# Altium project Jahwa_2.PrjPcb
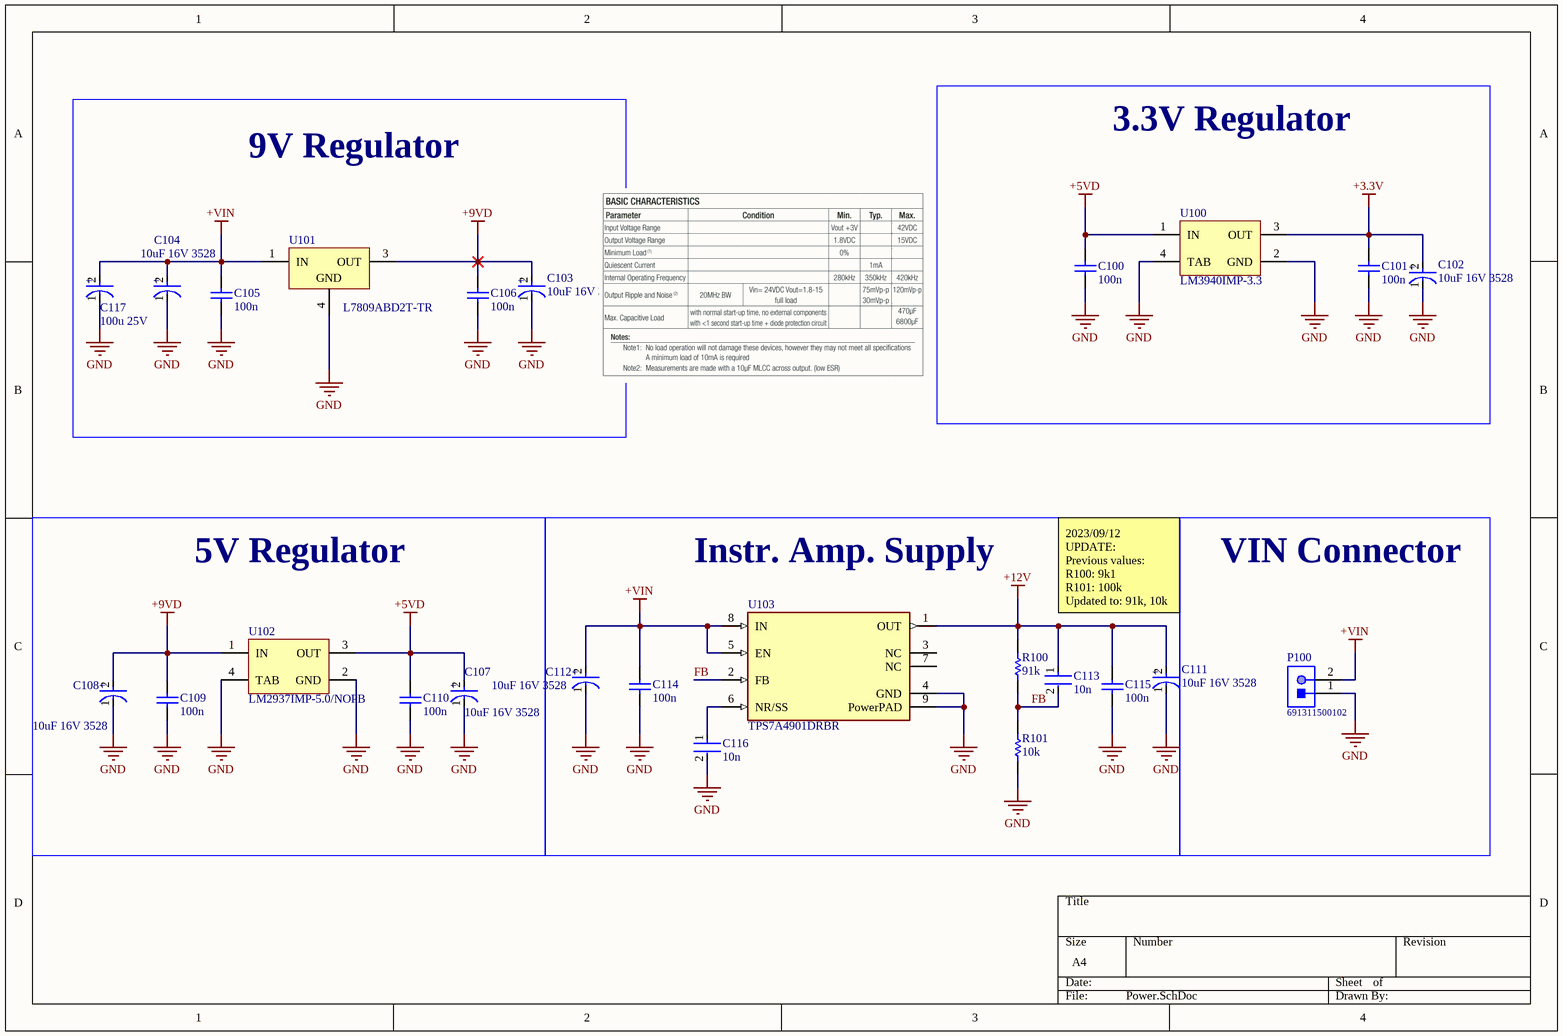
[diagram p0: Power.SchDoc]
4 sheets, 101 parts. Net scope: flat (ports and power ports of the same name join across sheets).
Board file: PCB.PcbDoc
Sheets:
  Power.SchDoc
  ADC.SchDoc
  Source_VDDP.SchDoc
  Source_VDDM.SchDoc

## Sheet Power.SchDoc
size A4; SheetNumber: 2; SheetTotal: 8

### Parts
C100  100n  [SAMS-C0603-2_M]
C101  100n  [SAMS-C0603-2_M]
C102  10uF 16V 3528  [FP-T491B106K020AT-MFG]
C103  10uF 16V 3528  [FP-T491B106K020AT-MFG]
C104  10uF 16V 3528  [FP-T491B106K020AT-MFG]
C105  100n  [SAMS-C0603-2_M]
C106  100n  [SAMS-C0603-2_M]
C107  10uF 16V 3528  [FP-T491B106K020AT-MFG]
C108  10uF 16V 3528  [FP-T491B106K020AT-MFG]
C109  100n  [SAMS-C0603-2_M]
C110  100n  [SAMS-C0603-2_M]
C111  10uF 16V 3528  [FP-T491B106K020AT-MFG]
C112  10uF 16V 3528  [FP-T491B106K020AT-MFG]
C113  10n  [FP-C0603C-CF-MFG]
C114  100n  [SAMS-C0603-2_M]
C115  100n  [SAMS-C0603-2_M]
C116  10n  [FP-C0603C-CF-MFG]
C117  100u 25V  [FP-T491X107K025AT-MFG]
P100  691311500102  [691311500102]
R100  91k  [RESC1608X55X30ML15T15]
R101  10k  [RESC1608X55X30ML15T15]
U100  LM3940IMP-3.3  [DCY0004A_L]
U101  L7809ABD2T-TR  [TO-263_N]
U102  LM2937IMP-5.0/NOPB  [DCY0004A_L]
U103  TPS7A4901DRBR  [FP-DRB0008A-MFG]

### Blocks framed on the sheet
3.3V Regulator: C100-C102 U100
9V Regulator: C103-C106 C117 U101
5V Regulator: C107-C110 U102
Instr. Amp. Supply: C111-C116 R100 R101 U103
VIN Connector: P100

### Nets
+3.3V: C101.2 C102.2(A) U100.3(OUT)
+5VD: C100.2 C107.2(A) C110.2 U100.1(IN) U102.3(OUT)
+9VD: C103.2(A) C106.2 C108.2(A) C109.2 U101.3(OUT) U102.1(IN)
+12V: C111.2(A) C113.1 C115.2 R100.2 U103.1(OUT)
+VIN: C104.2(A) C105.2 C112.2(A) C114.2 C117.2(A) P100.2 U101.1(IN) U103.5(EN) U103.8(IN)
GND: C100.1 C101.1 C102.1(C) C103.1(C) C104.1(C) C105.1 C106.1 C107.1(C) C108.1(C) C109.1 C110.1 C111.1(C) C112.1(C) C114.1 C115.1 C116.2 C117.1(C) P100.1 R101.1 U100.2(GND) U100.4(TAB) U101.4(GND) U102.2(GND) U102.4(TAB) U103.4(GND) U103.9(PowerPAD)
FB: C113.2 R100.1 R101.2 U103.2(FB)
NetC116_1: C116.1 U103.6(NR/SS)

Not connected (* = marked no-connect by the designer): U103 3(NC) 7(NC)

### Notes on the sheet
- 2023/09/12 UPDATE:
  Previous values:
  R100: 9k1
  R101: 100k
  Updated to: 91k, 10k
- (in symbol CMP-2000-07191-2) +
- (in symbol CMP-2000-07204-2) +

### Library data of the parts
C100 C101 C105 C106 C109 C110 C114 C115 = CMP-2000-05332-1: Multi-layer Ceramic Capacitor, -55 to 125 degC, 2-Pin SMD (0603), RoHS, Tape and Reel; Manufacturer: Samsung Electro-Mechanics; Capacitance: 0.1µF; Rated Voltage: 50V; Dielectric: X7R; Tolerance (%): ±10%; Case Size/Dimension: 0603; Datasheet URL: https://datasheet.ciiva.com/29198/456651-da-01-en-vs-kondensator-0605-29198839.pdf; Manufacturer URL: http://www.samsungsem.com/global/index.jsp; Datasheet Version: Nov-10
C102-C104 C107 C108 C111 C112 = CMP-2000-07191-2: CAP TANT 10UF 10% 20V 1411; Polarity: Polar; Life (Hours): 2000Hour; Dissipation Factor: 6%; Leakage Current: 2uA; Dielectric Material: Tantalum; Ripple Current: 201mA; ESR (Equivalent Series Resistance): 2.1R; Weight: 0.002293oz; Max Operating Temperature: 125°C; Failure Rate: 0.001%; Tolerance: 10%; Case Code (Metric): 3528; Case Code (Imperial): 1411; Number of Pins: 2; Case/Package: 1411; Width: 2.8mm; Height: 1.9mm; Voltage Rating: 20V; Voltage: 20V; Lead Free: Lead Free; Features: General Purpose; Radiation Hardening: No; Min Operating Temperature: -55°C; Length: 3.5mm; Mount: Surface Mount; Depth: 2.8mm; Voltage Rating (DC): 20V; Termination: SMD/SMT; Package Quantity: 1; Capacitance: 10uF; Packaging: Tape and Reel; RoHS Compliant: Yes; REACH SVHC: No SVHC; Height - Seated (Max): 0.083inch
C113 C116 = CMP-2006-03038-2: CAP CER 10000PF 200V X7R 0603; Manufacturer: KEMET; Manufacturer Part Number: C0603C103K2RACTU; Material: Ceramic; Value: 10,000 pF; Temperature Coefficient: 30ppm/°C; Tolerance: 0.1; Automotive Grade: Grade 1; Voltage Rating: 200 V; ComponentLink2Description: Datasheet; Package: C0603C-CF; Device Class L2: Capacitors; Mouser Description: Multilayer Ceramic Capacitors MLCC - SMD/SMT 200volts 10000pF X7R 10%; Device Class L3: Ceramic Capacitors; Temperature Range Low: -55°C; Category: Cap; Device Class L1: Passive Components; Lead Free: Yes; Octopart: https://octopart.com/c0603c103k2ractu-kemet-1061947; ComponentLink2URL: https://api.kemet.com/component-edge/download/datasheet/C0603C100J5GACAUTO.pdf; Temperature Characteristic: X7R; Temperature: -55°C to +125°C; Automotive: Yes; Temperature Range High: +125°C; Digikey Description: CAP CER 10000PF 200V X7R 0603; Height: 0.87mm; RoHS: TRUE; Capacitance: 10,000 pF
C117 = CMP-2000-07204-2: CAP TANT 100UF 10% 25V 2917; Leakage Current: 25uA; Ripple Current: 742mA; Polarity: Polar; Dissipation Factor: 8%; Life (Hours): 2000Hour; Dielectric Material: Tantalum; ESR (Equivalent Series Resistance): 300mR; Length: 7.3mm; RoHS Compliant: No; Failure Rate: 0.001%; REACH SVHC: No SVHC; Tolerance: 10%; Mount: Surface Mount; Height - Seated (Max): 0.169inch; Features: General Purpose; Height: 4mm; Package Quantity: 1; Case Code (Metric): 7343; Max Operating Temperature: 125°C; Number of Pins: 2; Radiation Hardening: No; Lead Free: Lead Free; Capacitance: 100uF; Termination: SMD/SMT; Voltage Rating: 25V; Series: T491; Depth: 4.3mm; Construction: Flat; Case/Package: 2917; Min Operating Temperature: -55°C; Voltage Rating (DC): 25V; Width: 4.3mm; Packaging: Tape and Reel; Case Code (Imperial): 2917; Voltage: 25V
P100 = CMP-1502-02146-1: Serie 311 - 5.08mm Close Vertical PCB Header WR-TBL, 2 pin; Manufacturer: Wurth Elektronik; Pin Number: 2; Gender: Male; Operating Temperature: -40to105degC; Package Reference: 691311500102; Packaging: Box; Part Number: 691311500102; Publisher: WurthElektronik; Datasheet URL: http://katalog.we-online.de/em/datasheet/6913115001xx.pdf; Mounting Technology: THT; Pitch: 5.08mm; Manufacturer URL: http://www.we-online.de
R100 = CMP-2000-00683-1: Manufacturer: Panasonic; Part Number: ERJ-3EKF9100V
R101 = CMP-2000-00182-1: Part Number: ERJ-3EKF1003V; Manufacturer: Panasonic
U100 = CMP-0062-01793-3: 1A Low Dropout Regulator for 5V to 3.3V Conversion, 4-pin SOT-223; Manufacturer: Texas Instruments; PackageTopMarking: XYTT*L52B; CompType: LDO IC; PowerWise: N; Code_JEDEC: TO-261-AA; PackageDescription: Molded SOT-223, 6.50 x 3.56 x 1.6mm Body, 4 Lead, 2.3mm Pitch; PinCount: 4; ComponentLink1Description: Datasheet URL; PackageReference: DCY0004A; Code_IPC: SOT223-4; ComponentLink1URL: http://www.ti.com/general/docs/lit/getliterature.tsp?genericPartNumber=LM3940&fileType=pdf; RoHS: N
U101 = CMP-0244-00211-1: Positive Voltage Regulator, 3-Pin D2PAK, Tape and Reel; ComponentLink2URL: http://www.st.com/internet/com/TECHNICAL_RESOURCES/TECHNICAL_LITERATURE/DATASHEET/CD00000444.pdf; PackageDescription: 3-Pin Transistor Outline Package 2.54 mm Pitch, 15.4 mm Lead Span (D2PAK); DatasheetVersion: 16/11/2011; PackageReference: TO-263; PackageVersion: 2011; ComponentLink1Description: Manufacturer URL; ComponentLink1URL: http://www.st.com; ComponentLink2Description: Datasheet
U102 = CMP-0062-01757-3: 500 mA Low Dropout Regulator, 4-pin SOT-223, Pb-Free; Manufacturer: Texas Instruments; PowerWise: N; CompType: LDO IC; PackageTopMarking: XYTT*L71B; Code_IPC: SOT223-4; ComponentLink1Description: Datasheet URL; ComponentLink1URL: http://www.ti.com/general/docs/lit/getliterature.tsp?genericPartNumber=LM2937&fileType=pdf; PackageDescription: Molded SOT-223, 6.50 x 3.56 x 1.6mm Body, 4 Lead, 2.3mm Pitch; PinCount: 4; RoHS: Y; PackageReference: DCY0004A; Code_JEDEC: TO-261-AA
U103 = CMP-04917-000048-2: None; Polarity: Positive; Max Input Voltage: 35V; Output Type: Adjustable; Output Voltage: 33V; Number of Regulators: 1; Quiescent Current: 100uA; Output Current: 150mA; Accuracy: 1.5%; Dropout Voltage: 333mV; Min Current Limit: 220mA; Min Input Voltage: 3V; Max Operating Temperature: 125°C; Min Operating Temperature: -40°C; Lead Free: Lead Free; Number of Pins: 8; Mount: Surface Mount; Packaging: Cut Tape; Number of Outputs: 1; RoHS Compliant: Yes; Contact Plating: Gold; Max Output Current: 150mA

## Sheet ADC.SchDoc
size A4; SheetNumber: 3; SheetTotal: 8
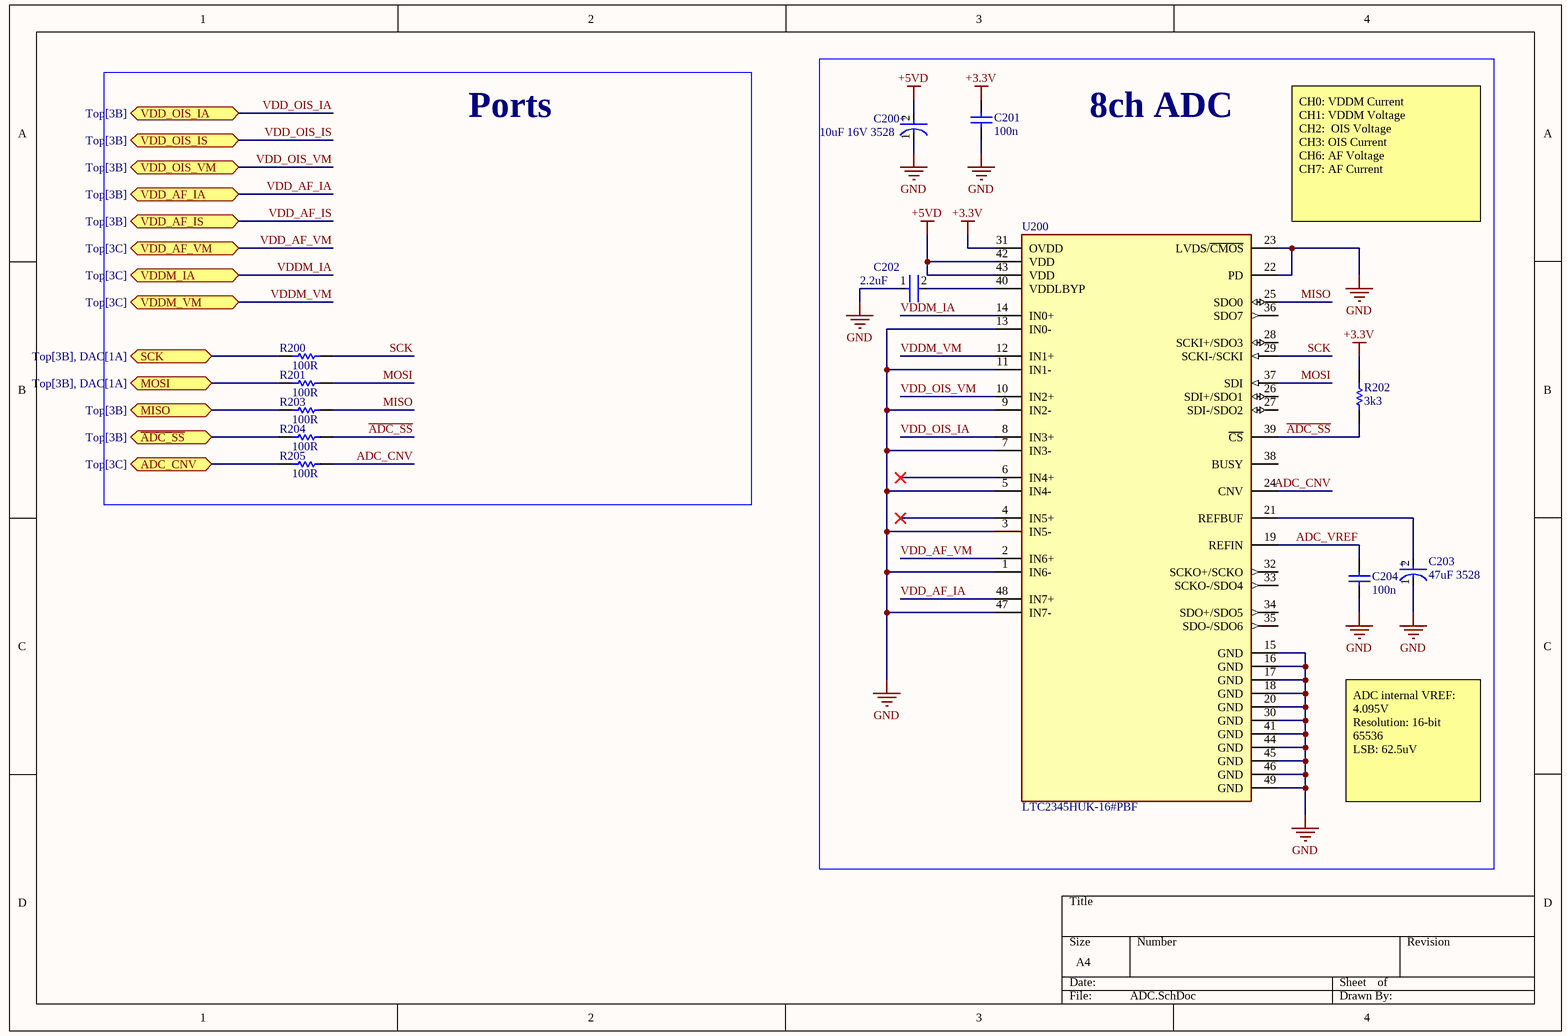
[diagram p1: ADC.SchDoc]

### Parts
C200  10uF 16V 3528  [FP-T491B106K020AT-MFG]
C201  100n  [SAMS-C0603-2_M]
C202  2.2uF  [FP-CL10-IPC_A]
C203  47uF 3528  [FP-TAJB-MFG]
C204  100n  [SAMS-C0603-2_M]
R200  100R  [RESC1608X55X30ML15T15]
R201  100R  [RESC1608X55X30ML15T15]
R202  3k3  [RESC1609X55X30ML15T15]
R203  100R  [RESC1608X55X30ML15T15]
R204  100R  [RESC1608X55X30ML15T15]
R205  100R  [RESC1608X55X30ML15T15]
U200  LTC2345HUK-16#PBF  [FP-UK-48-05-08-1704-MFG]

### Blocks framed on the sheet
Ports: R200 R201 R203-R205
8ch ADC: C200-C204 R202 U200

### Ports
ADC_CNV (bidir, see Top[3C]), MISO (bidir, see Top[3B]), MOSI (bidir, see Top[3B], DAC[1A]), SCK (bidir, see Top[3B], DAC[1A]), VDD_AF_IA (bidir, see Top[3B]), VDD_AF_IS (bidir, see Top[3B]), VDD_AF_VM (bidir, see Top[3C]), VDD_OIS_IA (bidir, see Top[3B]), VDD_OIS_IS (bidir, see Top[3B]), VDD_OIS_VM (bidir, see Top[3B]), VDDM_IA (bidir, see Top[3C]), VDDM_VM (bidir, see Top[3C]), ~{ADC_SS} (bidir, see Top[3B])

### Nets
+3.3V: C201.2 R202.1 U200.31(OVDD)
+5VD: C200.2(A) U200.42(VDD) U200.43(VDD)
GND: C200.1(C) C201.1 C202.1 C203.1(C) C204.1 U200.1(IN6-) U200.3(IN5-) U200.5(IN4-) U200.7(IN3-) U200.9(IN2-) U200.11(IN1-) U200.13(IN0-) U200.15(GND) U200.16(GND) U200.17(GND) U200.18(GND) U200.20(GND) U200.22(PD) U200.23(LVDS/~{CMOS}) U200.30(GND) U200.41(GND) U200.44(GND) U200.45(GND) U200.46(GND) U200.47(IN7-) U200.49(GND)
~{ADC_SS}: R202.2 R204.1 U200.39(~{CS})
ADC_CNV: R205.1 U200.24(CNV)
ADC_VREF: C204.2 U200.19(REFIN)
MISO: R203.1 U200.25(SDO0)
MOSI: R201.1 U200.37(SDI)
SCK: R200.1 U200.29(SCKI-/SCKI)
VDD_AF_IA: U200.48(IN7+) ; port VDD_AF_IA
VDD_AF_IS: port VDD_AF_IS
VDD_AF_VM: U200.2(IN6+) ; port VDD_AF_VM
VDD_OIS_IA: U200.8(IN3+) ; port VDD_OIS_IA
VDD_OIS_IS: port VDD_OIS_IS
VDD_OIS_VM: U200.10(IN2+) ; port VDD_OIS_VM
VDDM_IA: U200.14(IN0+) ; port VDDM_IA
VDDM_VM: U200.12(IN1+) ; port VDDM_VM
NetC202_2: C202.2 U200.40(VDDLBYP)
NetC203_2: C203.2(A) U200.21(REFBUF)
NetR200_2: R200.2 ; port SCK
NetR201_2: R201.2 ; port MOSI
NetR203_2: R203.2 ; port MISO
NetR204_2: R204.2 ; port ~{ADC_SS}
NetR205_2: R205.2 ; port ADC_CNV

Not connected (* = marked no-connect by the designer): U200 4(IN5+)* 6(IN4+)* 26(SDI+/SDO1) 27(SDI-/SDO2) 28(SCKI+/SDO3) 32(SCKO+/SCKO) 33(SCKO-/SDO4) 34(SDO+/SDO5) 35(SDO-/SDO6) 36(SDO7) 38(BUSY)

### Notes on the sheet
- (near U200) CH0: VDDM Current
  CH1: VDDM Voltage
  CH2:  OIS Voltage
  CH3: OIS Current
  CH6: AF Voltage
  CH7: AF Current
- ADC internal VREF: 4.095V
  Resolution: 16-bit
  65536
  LSB: 62.5uV
- (in symbol CMP-2000-07191-2) +
- (in symbol CMP-04424-000629-1) +

### Library data of the parts
C200 = CMP-2000-07191-2: as C102 on sheet Power; Weight: 0.002293oz; Max Operating Temperature: 125°C; Failure Rate: 0.001%; Tolerance: 10%; Case Code (Metric): 3528; Case Code (Imperial): 1411; Number of Pins: 2; Case/Package: 1411; Width: 2.8mm; Height: 1.9mm; Voltage Rating: 20V; Voltage: 20V; Lead Free: Lead Free; Features: General Purpose; Radiation Hardening: No; Min Operating Temperature: -55°C; Length: 3.5mm; Mount: Surface Mount; Depth: 2.8mm; Voltage Rating (DC): 20V; Termination: SMD/SMT; Package Quantity: 1; Capacitance: 10uF; Packaging: Tape and Reel; RoHS Compliant: Yes; REACH SVHC: No SVHC; Height - Seated (Max): 0.083inch
C201 C204 = CMP-2000-05332-1: as C100 on sheet Power; Case Size/Dimension: 0603; Datasheet URL: https://datasheet.ciiva.com/29198/456651-da-01-en-vs-kondensator-0605-29198839.pdf; Manufacturer URL: http://www.samsungsem.com/global/index.jsp; Datasheet Version: Nov-10
C202 = CMP-13271-003582-1: Cap Ceramic 2.2uF 10V X7R ±10% Pad SMD 0603 +125°C T/R; Max Operating Temperature: 125°C; Package Quantity: 1; Thickness: 0.035inch; Capacitance: 2.2uF; Height: 0.8mm; Case/Package: 0603; Case Code (Metric): 1608; Radiation Hardening: No; Dielectric: X7R; Mount: Surface Mount; Contact Plating: Tin; Material: Ceramic; Length: 1.6mm; Packaging: Tape and Reel; Width: 0.031inch; Min Operating Temperature: -55°C; Case Code (Imperial): 0603; Depth: 0.8mm; Voltage Rating: 10V; Tolerance: 10%
C203 = CMP-04424-000629-1: 47uF 10V  ±10% 1Ω 1210  SMD Tantalum Capacitor; Leakage Current: 4.7uA; ESR (Equivalent Series Resistance): 1R; Dissipation Factor: 8%; Polarity: Polar; Package Quantity: 1; Length: 3.5mm; Dielectric Material: Tantalum; Series: TAJ; Termination: SMD/SMT; Case Code (Metric): 3528; Case Code (Imperial): 1210; Height - Seated (Max): 0.083inch; Lead Pitch: 1.4mm; Features: General Purpose; Radiation Hardening: No; Lead Free: Lead Free; Construction: Flat; RoHS Compliant: Yes; Case/Package: 1210; Min Operating Temperature: -55°C; Voltage: 10V; Depth: 2.8mm; Mount: Surface Mount; REACH SVHC: No SVHC; Width: 0.11inch; Voltage Rating (DC): 10V; Max Operating Temperature: 125°C; Capacitance: 47uF; Tolerance: 10%; Voltage Rating: 10V; Packaging: Tape and Reel; Number of Pins: 2; Height: 1.9mm
R200 R201 R203-R205 = CMP-2000-00179-1: Manufacturer: Panasonic; Part Number: ERJ-3EKF1000V
R202 = CMP-2000-00436-2: Chip Resistors, 3.3 KOhm, +/- 1%, 0.1 W, 0603 (1608 Metric), -55 to 155 degC, RoHS, Tape and Reel; Manufacturer: Panasonic; Max Power Dissipation: 100mW; Voltage Rating: 75V; Temperature Coefficient: 100ppm/degreesC; Datasheet Version: 42095.0; Width: 0.8mm; Mount: SurfaceMount; Radiation Hardening: No; Package URL: http://www.st.com/st-web-ui/static/active/en/resource/technical/document/datasheet/CD00001320.pdf; Depth: 0.8mm; Package Description: 2-Pin Surface Mount Device, Body 1.6 x 0.85 mm; Package Quantity: 1; Contact Plating: Tin; Length: 1.6mm; Max Operating Temperature: 155degC; RoHSCompliant: true; Datasheet URL: https://industrial.panasonic.com/cdbs/www-data/pdf/RDA0000/AOA0000C283.pdf; Height: 0.022inch; Military Standard: Not; Termination: SMD/SMT; Case Code (Metric): 1608; Composition: ThickFilm; Resistance: 3.3KOhm; Packaging: TapeandReel; Min Operating Temperature: -55degC; Case/Package: 0603; Voltage Rating (DC): 75V; Lead Free: LeadFree; Package Reference: 0603; Power Rating: 100mW; Manufacturer URL: http://www.panasonic.com/; Case Code (Imperial): 0603; REACH SVHC: NoSVHC; Number of Terminations: 2; Number of Pins: 2; Tolerance: 1%
U200 = CMP-09081-000619-1: IC ADC 16BIT SAR 48QFN; Number of Bits: 16; Resolution: 16b; Input Type: DIFFERENTIAL; Max Supply Voltage: 5.25V; Interface: SPI; Min Supply Voltage: 4.75V; Sampling Rate: 200000S/s; Number of Inputs: 8; Number of A/D Converters: 1; Max Operating Temperature: 125°C; Series: SoftSpan™; Case/Package: QFN; Min Operating Temperature: -40°C; REACH SVHC: No SVHC; RoHS Compliant: Yes; Number of Pins: 48; Packaging: Rail/Tube

## Sheet Source_VDDP.SchDoc
size A4; SheetNumber: 4; SheetTotal: 8
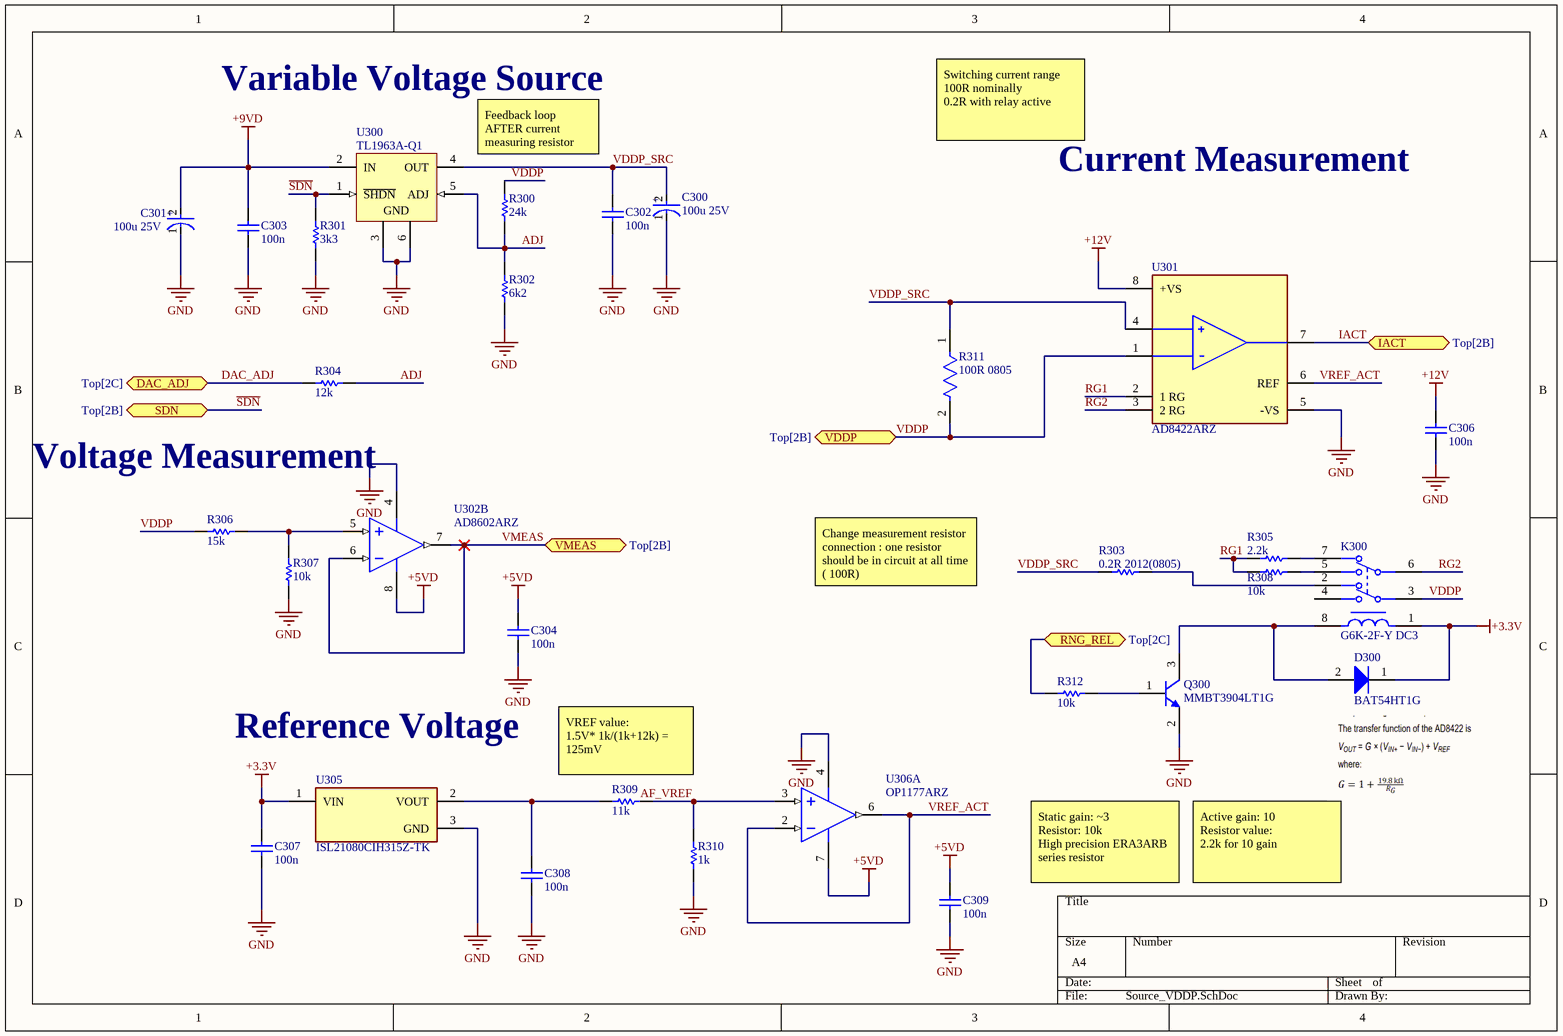
[diagram p2: Source_VDDP.SchDoc]

### Parts
C300  100u 25V  [FP-T491X107K025AT-MFG]
C301  100u 25V  [FP-T491X107K025AT-MFG]
C302  100n  [SAMS-C0603-2_M]
C303  100n  [SAMS-C0603-2_M]
C304  100n  [SAMS-C0603-2_M]
C306  100n  [SAMS-C0603-2_M]
C307  100n  [SAMS-C0603-2_M]
C308  100n  [SAMS-C0603-2_M]
C309  100n  [SAMS-C0603-2_M]
D300  BAT54HT1G  [ONSC-SOD-323-2-477-02_V]
K300  G6K-2F-Y DC3  [FP-G6K-2F-Y_DC3-MFG]
Q300  MMBT3904LT1G  [ONSC-SOT-23-3-318-08_V]
R300  24k  [RESC1608X55X30ML15T15]
R301  3k3  [RESC1609X55X30ML15T15]
R302  6k2  [RESC1608X55X30ML15T15]
R303  0.2R 2012(0805)  [RESC2013X46X38ML25T25]
R304  12k  [RESC1608X55X30ML15T15]
R305  2.2k  [RESC1609X55X30ML15T15]
R306  15k  [RESC1608X55X30ML15T15]
R307  10k  [RESC1608X55X30ML15T15]
R308  10k  [RESC1608X55X30ML15T15]
R309  11k  [RESC1608X55X30ML15T15]
R310  1k  [RESC1608X55X30ML15T15]
R311  100R 0805  [FP-CRCW0805-e3-MFG]
R312  10k  [RESC1608X55X30ML15T15]
U300  TL1963A-Q1  [KTT0005A_M]
U301  AD8422ARZ  [FP-R-8-IPC_A]
U302  AD8602ARZ  [ADI-R-8_N]  (part B of 2)
U305  ISL21080CIH315Z-TK  [FP-P3_064A-IPC_A]
U306  OP1177ARZ  [ADI-R-8_M]  (part A of 2)

### Ports
DAC_ADJ (bidir, see Top[2C]), IACT (bidir, see Top[2B]), RNG_REL (bidir, see Top[2C]), SDN (bidir, see Top[2B]), VDDP (bidir, see Top[2B]), VMEAS (bidir, see Top[2B])

### Nets
+3.3V: C307.2 D300.1(K) K300.1 U305.1(VIN)
+5VD: C304.2 C309.2 U302.8(+V) U306.7(+V)
+9VD: C301.2(A) C303.2 U300.2(IN)
+12V: C306.2 U301.8(+VS)
GND: C300.1(C) C301.1(C) C302.1 C303.1 C304.1 C306.1 C307.1 C308.1 C309.1 Q300.2(E) R301.1 R302.1 R307.1 R310.1 U300.3(GND) U300.6(GND) U301.5(-VS) U302.4(-V) U305.3(GND) U306.4(-V)
~{SDN}: R301.2 U300.1(~{SHDN}) ; port SDN
ADJ: R300.1 R302.2 R304.2 U300.5(ADJ)
AF_VREF: R309.1 R310.2 U306.3(+IN)
DAC_ADJ: R304.1 ; port DAC_ADJ
IACT: U301.7(VOUT) ; port IACT
RG1: R305.1 R308.1 U301.2(1_RG)
RG2: K300.6 U301.3(2_RG)
VDDP: K300.3 R300.2 R306.1 R311.2 U301.1(-IN) ; port VDDP
VDDP_SRC: C300.2(A) C302.2 R303.2 R311.1 U300.4(OUT) U301.4(+IN)
VMEAS: U302.6(-IN_B) U302.7(OUT_B) ; port VMEAS
VREF_ACT: U301.6(REF) U306.2(-IN) U306.6(OUT)
NetC308_2: C308.2 R309.2 U305.2(VOUT)
NetD300_2: D300.2(A) K300.8 Q300.3(C)
NetK300_2: K300.2 R303.1
NetK300_5: K300.5 R308.2
NetK300_7: K300.7 R305.2
NetQ300_1: Q300.1(B) R312.1
NetR306_2: R306.2 R307.2 U302.5(+IN_B)
NetR312_2: R312.2 ; port RNG_REL

Not connected (* = marked no-connect by the designer): K300 4

### Notes on the sheet
- Variable Voltage Source
- Feedback loop AFTER current measuring resistor
- Switching current range
  100R nominally
  0.2R with relay active
- Current Measurement
- Voltage Measurement
- Change measurement resistor connection : one resistor should be in circuit at all time ( 100R)
- Reference Voltage
- (near R309) VREF value:
  1.5V* 1k/(1k+12k) = 125mV
- Static gain: ~3
  Resistor: 10k
  High precision ERA3ARB series resistor
- Active gain: 10
  Resistor value:
  2.2k for 10 gain
- (in symbol CMP-2000-07204-2) +

### Library data of the parts
C300 C301 = CMP-2000-07204-2: as C117 on sheet Power; Length: 7.3mm; RoHS Compliant: No; Failure Rate: 0.001%; REACH SVHC: No SVHC; Tolerance: 10%; Mount: Surface Mount; Height - Seated (Max): 0.169inch; Features: General Purpose; Height: 4mm; Package Quantity: 1; Case Code (Metric): 7343; Max Operating Temperature: 125°C; Number of Pins: 2; Radiation Hardening: No; Lead Free: Lead Free; Capacitance: 100uF; Termination: SMD/SMT; Voltage Rating: 25V; Series: T491; Depth: 4.3mm; Construction: Flat; Case/Package: 2917; Min Operating Temperature: -55°C; Voltage Rating (DC): 25V; Width: 4.3mm; Packaging: Tape and Reel; Case Code (Imperial): 2917; Voltage: 25V
C302-C304 C306-C309 = CMP-2000-05332-1: as C100 on sheet Power; Case Size/Dimension: 0603; Datasheet URL: https://datasheet.ciiva.com/29198/456651-da-01-en-vs-kondensator-0605-29198839.pdf; Manufacturer URL: http://www.samsungsem.com/global/index.jsp; Datasheet Version: Nov-10
D300 = CMP-1055-00462-1: Schottky Barrier Diode, 2-Pin SOD-323, Pb-Free, Tape and Reel; Manufacturer: On Semiconductor; Configuration: Single; trr Max (ns): 5; IFSM Max (A): 0.6; ComponentLink3URL: http://www.onsemi.com/pub_link/Collateral/477-02.PDF.1; PackageDescription: 2-Pin SOD, Body 1.7 x 1.25 mm; ComponentLink2URL: http://www.onsemi.cn/pub_link/Collateral/BAT54HT1-D.PDF; ComponentLink3Description: Package Specification; ComponentLink2Description: Datasheet; DatasheetVersion: Rev. 6; PackageReference: SOD-323-2-477-02; RoHS: TRUE; ComponentLink1URL: http://www.onsemi.com/; Packing: Tape and Reel; PartNumber: BAT54HT1G; Mounting Technology: Surface Mount; ComponentLink1Description: Manufacturer URL; PackageVersion: Rev. H, 03/2007
K300 = CMP-08823-000016-1: RELAY TELECOM DPDT 1A 3VDC; Manufacturer: Omron; Coil Power: 100mW; Coil Current: 33mA; Coil Voltage: 3V; Number Of Contacts: 2; Coil Resistance: 91Ω; Standoff Height: 0.3mm; Coil Type: Non-Latching; Current Rating: 2A; Package: 0; Device Class L2: Relays; Throw Configuration: DPDT; Ambient Temperature Range High: +70°C; Device Class L3: Signal Relays; Temperature Range Low: -40°C; Digikey Description: RELAY TELECOM DPDT 1A 3VDC; RoHS: TRUE; Height: 5.4mm; Temperature Range High: +70°C; Lead Free: Yes; Manufacturer Part Number: G6K-2F-Y DC3; Device Class L1: Electromechanical; Octopart: https://octopart.com/g6k-2f-y-dc3-omron-694063; Temperature: -40°C to +70°C; ComponentLink2URL: https://omronfs.omron.com/en_US/ecb/products/pdf/en-g6k.pdf; Automotive: No; Ambient Temperature Range Low: -40°C; Category: Relay; ComponentLink2Description: Datasheet; Switching Current: 1A
Q300 = CMP-1048-00631-1: General Purpose Transistor, NPN Silicon, 3-Pin SOT-23, Pb-Free, Tape and Reel; Manufacturer: On Semiconductor; IC Continuous (A): 0.2; fT Min (MHz): 300; ComponentLink2Description: Datasheet; Polarity: NPN; PackageDescription: 3-Pin Small Outline Transistor, Body 2.92 x 1.3 mm, Pitch 0.95 mm; ComponentLink2URL: http://www.onsemi.cn/pub_link/Collateral/MMBT3904LT1-D.PDF; DatasheetVersion: Rev. 12; Mounting Technology: Surface Mount; PartNumber: MMBT3904LT1G; ComponentLink1URL: http://www.onsemi.com/; ComponentLink3Description: Package Specification; ComponentLink1Description: Manufacturer URL; PackageVersion: Rev. AP, 11/2009; PackageReference: SOT-23-3-318-08; Packing: Tape and Reel; ComponentLink3URL: http://www.onsemi.cn/pub_link/Collateral/318-08.PDF; RoHS: TRUE
R300 = CMP-2000-00362-1: Part Number: ERJ-3EKF2402V; Manufacturer: Panasonic
R301 = CMP-2000-00436-2: as R202 on sheet ADC; Datasheet Version: 42095.0; Width: 0.8mm; Mount: SurfaceMount; Radiation Hardening: No; Package URL: http://www.st.com/st-web-ui/static/active/en/resource/technical/document/datasheet/CD00001320.pdf; Depth: 0.8mm; Package Description: 2-Pin Surface Mount Device, Body 1.6 x 0.85 mm; Package Quantity: 1; Contact Plating: Tin; Length: 1.6mm; Max Operating Temperature: 155degC; RoHSCompliant: true; Datasheet URL: https://industrial.panasonic.com/cdbs/www-data/pdf/RDA0000/AOA0000C283.pdf; Height: 0.022inch; Military Standard: Not; Termination: SMD/SMT; Case Code (Metric): 1608; Composition: ThickFilm; Resistance: 3.3KOhm; Packaging: TapeandReel; Min Operating Temperature: -55degC; Case/Package: 0603; Voltage Rating (DC): 75V; Lead Free: LeadFree; Package Reference: 0603; Power Rating: 100mW; Manufacturer URL: http://www.panasonic.com/; Case Code (Imperial): 0603; REACH SVHC: NoSVHC; Number of Terminations: 2; Number of Pins: 2; Tolerance: 1%
R302 = CMP-2000-00594-1: Manufacturer: Panasonic; Part Number: ERJ-3EKF6200V
R303 = CMP-2001-04350-1: Part Number: WSL0805R2000FEA; Manufacturer: Vishay Dale
R304 = CMP-1012-00057-2: Part Number: ERJ-3GEYJ201V; Manufacturer: Panasonic
R305 = CMP-2000-00214-2: Chip Resistor, 1.2 KOhm, +/- 1%, 0.1 W, -55 to 155 degC, 0603 (1608 Metric), RoHS, Tape and Reel; Manufacturer: Panasonic; Max Power Dissipation: 100mW; Voltage Rating (DC): 75V; Temperature Coefficient: 100ppm/degC; Package Description: 2-Pin Surface Mount Device, Body 1.6 x 0.85 mm; Contact Plating: Tin; Number of Pins: 2; Resistance: 1.2KOhm; Length: 1.6mm; Height: 0.022inch; Number of Terminations: 2; Mount: SurfaceMount; Package Reference: 0603; Packaging: TapeandReel; Case Code (Metric): 1608; Datasheet Version: 42095.0; Datasheet URL: https://industrial.panasonic.com/cdbs/www-data/pdf/RDA0000/AOA0000C283.pdf; Depth: 0.8mm; REACH SVHC: NoSVHC; Case/Package: 0603; Min Operating Temperature: -55degC; Composition: ThickFilm; Manufacturer URL: http://www.panasonic.com/; Termination: SMD/SMT; Package Quantity: 1; Case Code (Imperial): 0603; Width: 0.031inch; Power Rating: 100mW; Voltage Rating: 75V; Lead Free: LeadFree; Package URL: http://www.st.com/st-web-ui/static/active/en/resource/technical/document/datasheet/CD00001320.pdf; RoHSCompliant: True; Tolerance: 1%; Military Standard: Not; Max Operating Temperature: 155degC
R306 = CMP-2000-00460-1: Part Number: ERJ-3EKF3602V; Manufacturer: Panasonic
R307 R312 = CMP-1012-00109-2: Part Number: ERJ-3GEYJ303V; Manufacturer: Panasonic
R308 = CMP-1012-00320-3: Chip Resistor, 22 Ohm, +/- 1%, 0.1 W, -55 to 155 degC, 0603 (1608 Metric), RoHS, Tape and Reel; PackageReference: 0603; ComponentLink2URL: http://industrial.panasonic.com/cdbs/www-data/pdf/RDA0000/AOA0000C86.pdf; ComponentLink2Description: Datasheet; PackageDescription: 2-Pin Surface Mount Device, Body 1.6 x 0.85 mm; ComponentLink1URL: http://www.panasonic.com/; ComponentLink1Description: Manufacturer URL; DatasheetVersion: Apr-15
R309 = CMP-2000-00199-1: Part Number: ERJ-3EKF1102V; Manufacturer: Panasonic
R310 = CMP-2000-00180-1: Part Number: ERJ-3EKF1001V; Manufacturer: Panasonic
R311 = CMP-1013-00397-3: RES Thick Film, 100Ω, 1%, 0.125W, 100ppm/°C, 0805; Max Power Dissipation: 125mW; Voltage Rating (DC): 150V; Contact Plating: Tin; Weight: 0.000194oz; Resistance: 100R; Temperature Coefficient: 100ppm/°C; Max Operating Temperature: 155°C; Power Rating: 125mW; Radiation Hardening: No; Length: 2mm; Number of Terminations: 2; Case Code (Metric): 2012; Packaging: Tape and Reel; Min Operating Temperature: -55°C; Depth: 1.25mm; Composition: Thick Film; Case Code (Imperial): 0805; Military Standard: Not; Height: 0.02inch; Case/Package: 0805; Width: 0.049inch; Voltage Rating: 150V; Tolerance: 1%; Package Quantity: 10000; Features: Automotive AEC-Q200; Lead Free: Lead Free
U300 = CMP-0395-00836-2: Single Output Fast Transient Response LDO, 1.5 A, Adjustable 1.21 to 20 V Output, 2.1 to 20 V Input, 5-pin DDPAK (KTT), -40 to 125 degC, Green (RoHS & no Sb/Br); PartNumber: TL1963AKTTR; Manufacturer: Texas Instruments; Vout Adj(Min)(V): 1.21; Vout Adj(Max)(V): 20; Iout(Max)(A): 1.5; SubFamily: Single Channel LDO; Iq(Typ)(mA): 1; Vin(Min)(V): 2.1; Vdo(Typ)(mV): 340; Mounting Technology: Surface Mount; DatasheetVersion: SLVS719F; PackageDescription: 3-Pin Plastic Flange Mount, Body 10.16 x 10.34 mm, Pitch 1.7 mm; ComponentLink2Description: Datasheet; ComponentLink2URL: http://www.ti.com/general/docs/lit/getliterature.tsp?genericPartNumber=TL1963A&fileType=pdf; ComponentLink1URL: http://www.ti.com/; Vin(Max)(V): 20; ComponentLink3URL: http://www.ti.com/litv/pdf/mpsf007e; PackageVersion: 4200577-3/F; ComponentLink3Description: Package Specification; PackageReference: KTT0005A; ComponentLink1Description: Manufacturer URL; Eco-Plan: Green (RoHS & no Sb/Br); Code_JEDEC: TO-263
U301 = CMP-09116-000053-1: IC INST AMP 1 CIRCUIT 8SOIC; Number of Amplifiers: 1; Max Supply Current: 1nA; Max Dual Supply Voltage: 18V; Max Supply Voltage: 3.6V; Input Offset Voltage (Vos): 0.3uV; -3db Bandwidth: 2.2MHz; Min Dual Supply Voltage: 1.8V; Output Current per Channel: 20mA; Slew Rate: 0.8V/µs; Input Bias Current: 500pA; Nominal Supply Current: 300uA; Common Mode Rejection Ratio: 94dB; Mount: Surface Mount; Case/Package: SOIC; Radiation Hardening: No; Number of Circuits: 1; Max Operating Temperature: 85°C; Package Quantity: 98; Number of Pins: 8; Lead Free: Contains Lead; REACH SVHC: No SVHC; Number of Channels: 1; Contact Plating: Tin; Packaging: Rail/Tube; Min Operating Temperature: -40°C; Gain Bandwidth Product: 2.2MHz; Bandwidth: 2.2MHz; Min Supply Voltage: 3.6V; Operating Supply Current: 300uA; Length: 5mm; Width: 4mm; Height: 1.5mm
U302 = CMP-0384-00551-1: Double Channel Wide Bandwidth Operational Amplifier, 8.4 MHz BW, 6 V/us SR, Industrial, 8-pin SOIC (R-8), Tube; Generic Part Number: AD8602; Manufacturer: Analog Devices; Input Offset Voltage: 500uV; V Span Min: 2.7V; Small Signal Bandwidth: 8.4MHz; Automotive Qualified: Yes; Input Bias Current: 200fA; Iq/Amp: 1.2mA; Amplifiers Per Package: 2; Slew Rate: 6V/us; V Span Max: 6V; Code_JEDEC: MS-012-AA; ComponentLink2Description: Datasheet; ComponentLink2URL: http://www.analog.com/static/imported-files/data_sheets/AD8601_8602_8604.pdf; ComponentLink3URL: http://www.analog.com/static/imported-files/packages/PKG_PDF/SOIC_Narrow%20(R)/R_8.pdf; ComponentLink1URL: http://www.analog.com/en/index.html; ComponentLink3Description: Package Specification; PartNumber: AD8602ARZ; Mounting Technology: Surface Mount; PackageReference: R-8; PackageDescription: 8-Pin Standard Small Outline Package, Body 3.9 x 4.9 mm, Pitch 1.27 mm; DatasheetVersion: Rev. G; PackageVersion: 060506-A; ComponentLink1Description: Manufacturer URL
U305 = CMP-13559-000003-1: IC VREF SERIES 0.5% SOT23-3; RoHS Compliant: Yes
U306 = CMP-0384-00637-2: Single Channel Wide Bandwidth Operational Amplifier, 1.3 MHz BW, 700 mV/us SR, Industrial, 8-pin SOIC (R-8), Tube; Manufacturer: Analog Devices; Generic Part Number: OP1177; Input Bias Current: 500pA; Amplifiers Per Package: 1; Input Offset Voltage: 15uV; Iq/Amp: 500uA; V Span Max: 36V; V Span Min: 5V; Small Signal Bandwidth: 1.3MHz; Mounting Technology: Surface Mount; Code_JEDEC: MS-012-AA; ComponentLink4Description: Reference Circuit; ComponentLink3Description: Package Specification; PackageVersion: 060506-A; Slew Rate: 700mV/us; RevisionNote: Reference Circuit URL fixed; ComponentLink3URL: http://www.analog.com/static/imported-files/packages/PKG_PDF/SOIC_Narrow%20(R)/R_8.pdf; DatasheetVersion: Rev. G; PartNumber: OP1177ARZ; ComponentLink1URL: http://www.analog.com/en/index.html; ComponentLink1Description: Manufacturer URL; ComponentLink2URL: http://www.analog.com/static/imported-files/data_sheets/OP1177_2177_4177.pdf; PackageReference: R-8; ComponentLink4URL: http://www.analog.com/en/all-operational-amplifiers-op-amps/operational-amplifiers-op-amps/op1177/products/product.html#product-recommendations; ComponentLink2Description: Datasheet; PackageDescription: 8-Pin Standard Small Outline Package, Body 3.9 x 4.9 mm, Pitch 1.27 mm

## Sheet Source_VDDM.SchDoc
size A3; SheetNumber: 5; SheetTotal: 8
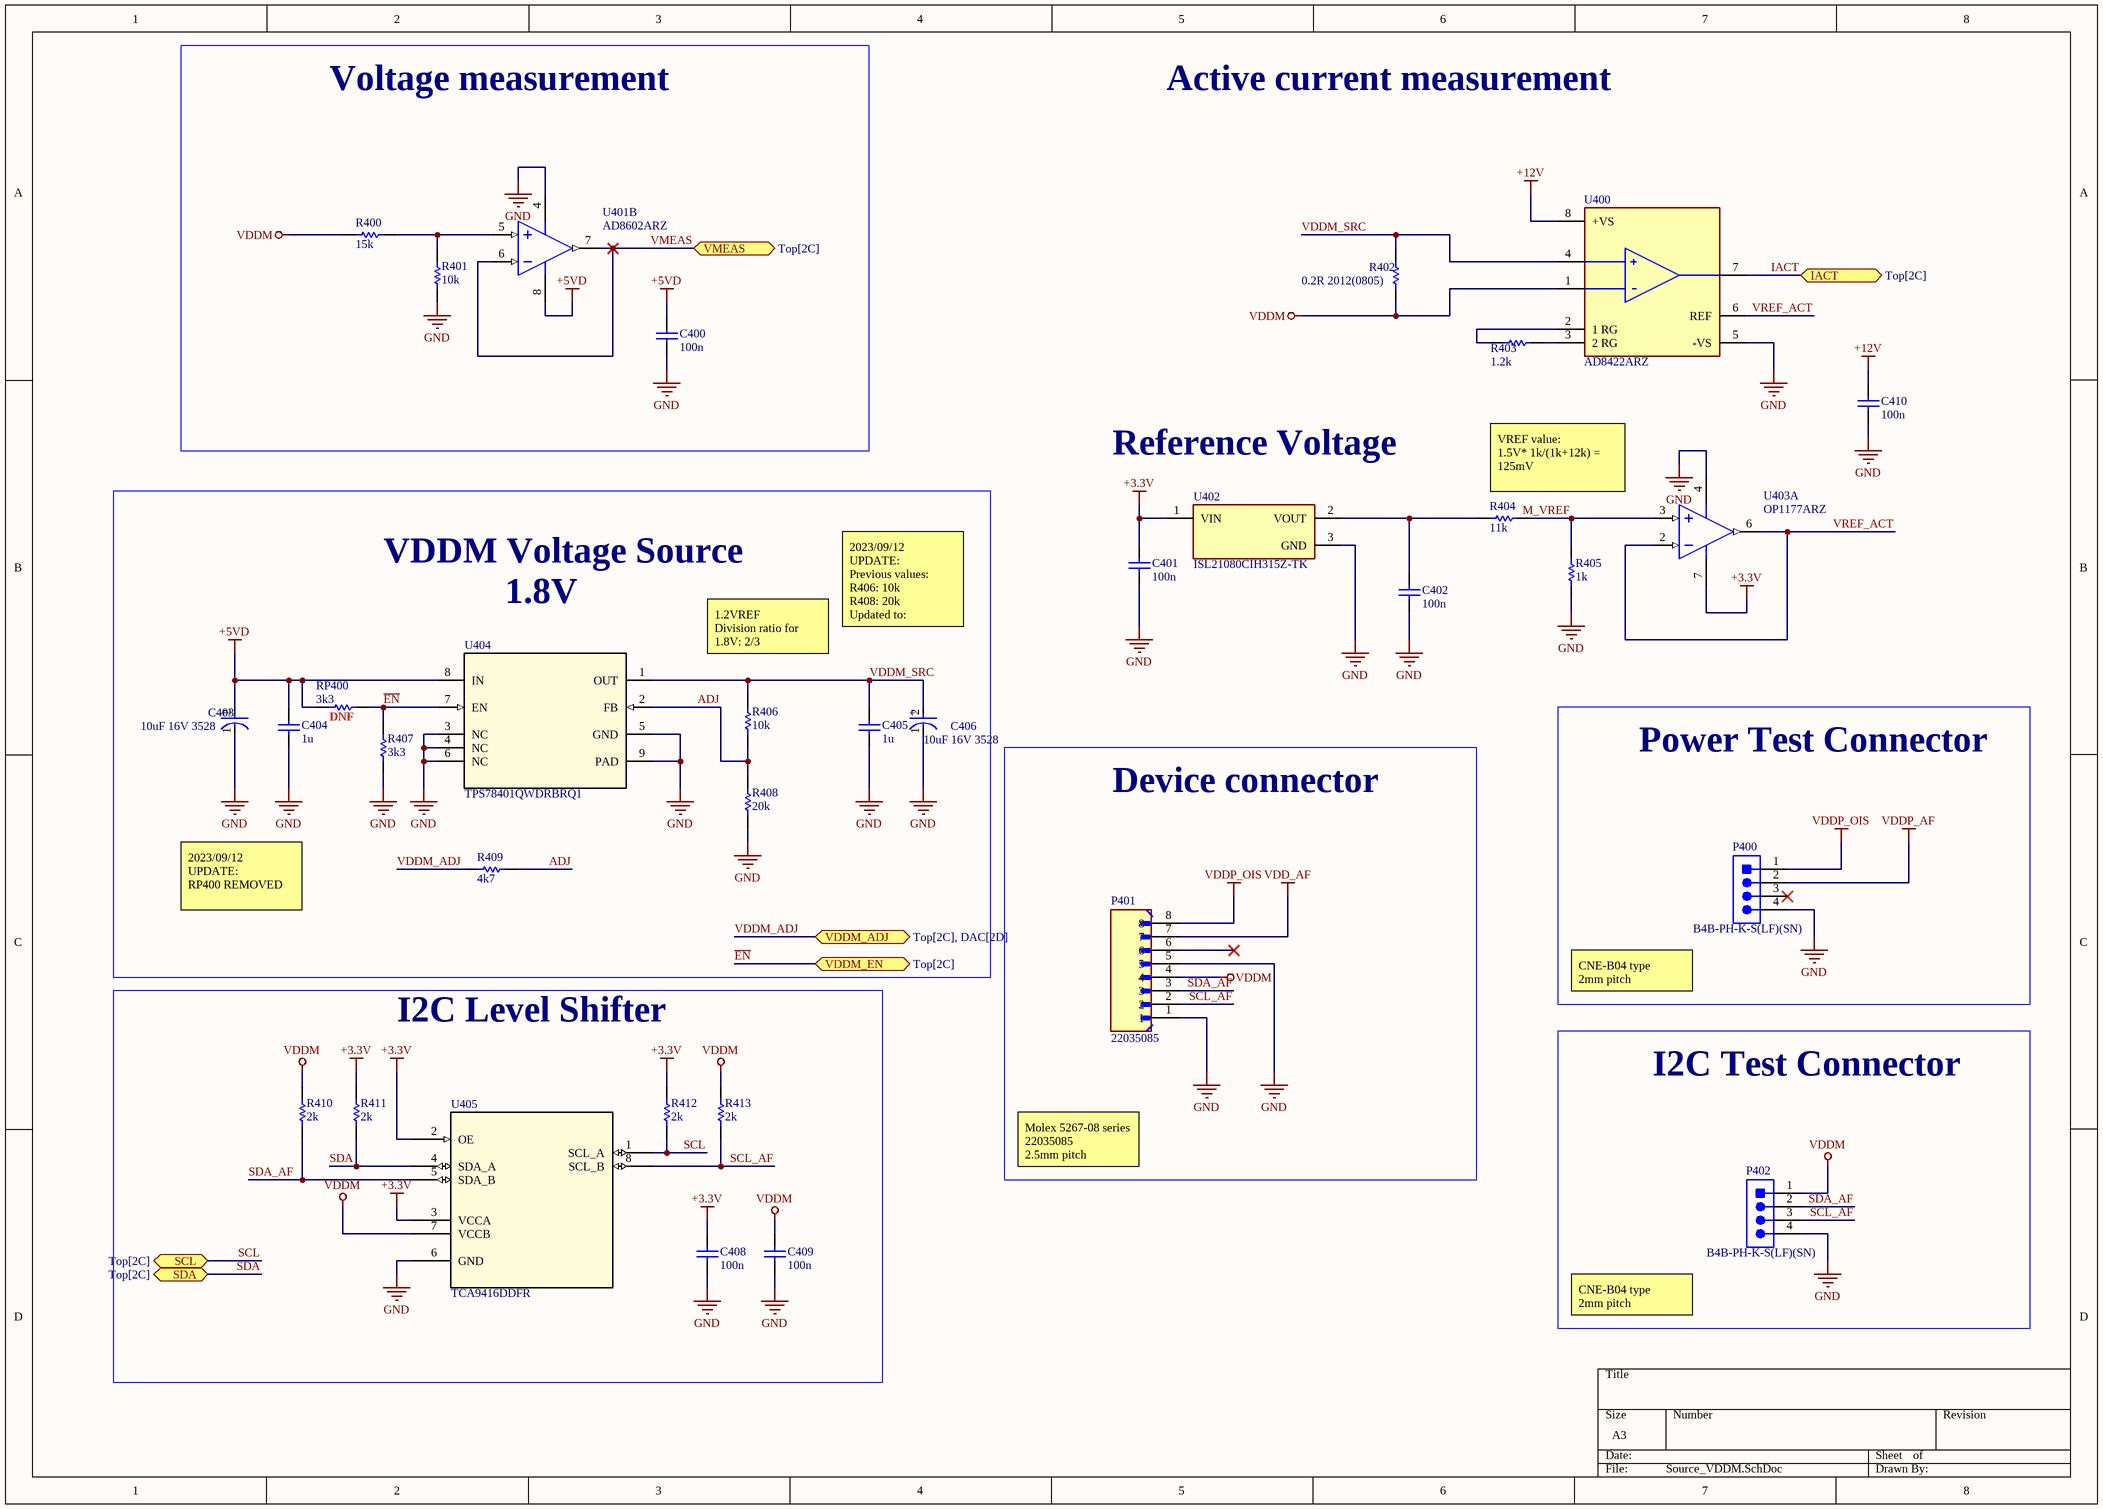
[diagram p3: Source_VDDM.SchDoc]

### Parts
C400  100n  [SAMS-C0603-2_M]
C401  100n  [SAMS-C0603-2_M]
C402  100n  [SAMS-C0603-2_M]
C403  10uF 16V 3528  [FP-T491B106K020AT-MFG]
C404  1u  [CAPC2013X70X45NL10T25]
C405  1u  [CAPC2013X70X45NL10T25]
C406  10uF 16V 3528  [FP-T491B106K020AT-MFG]
C408  100n  [SAMS-C0603-2_M]
C409  100n  [SAMS-C0603-2_M]
C410  100n  [SAMS-C0603-2_M]
P400  B4B-PH-K-S(LF)(SN)  [JST-B4B-PH-K-S_V]
P401  22035085  [MOLEX_22035085]
P402  B4B-PH-K-S(LF)(SN)  [JST-B4B-PH-K-S_V]
R400  15k  [RESC1608X55X30ML15T15]
R401  10k  [RESC1608X55X30ML15T15]
R402  0.2R 2012(0805)  [RESC2013X46X38ML25T25]
R403  1.2k  [RESC1609X55X30ML15T15]
R404  11k  [RESC1608X55X30ML15T15]
R405  1k  [RESC1608X55X30ML15T15]
R406  10k  [RESC1609X55X30ML15T15]
R407  3k3  [RESC1609X55X30ML15T15]
R408  20k  [RESC1609X55X30ML15T15]
R409  4k7  [RESC1608X55X30ML15T15]
R410  2k  [RESC1608X55X30ML15T15]
R411  2k  [RESC1608X55X30ML15T15]
R412  2k  [RESC1608X55X30ML15T15]
R413  2k  [RESC1608X55X30ML15T15]
RP400  3k3  [RESC1609X55X30ML15T15]
U400  AD8422ARZ  [FP-R-8-IPC_A]
U401  AD8602ARZ  [ADI-R-8_N]  (part B of 2)
U402  ISL21080CIH315Z-TK  [FP-P3_064A-IPC_A]
U403  OP1177ARZ  [ADI-R-8_M]  (part A of 2)
U404  TPS78401QWDRBRQ1  [DRB0008J-IPC_A]
U405  TCA9416DDFR  [SOT_16DDFR_TEX]

### Blocks framed on the sheet
Voltage measurement: C400 R400 R401 U401
Power Test Connector: P400
Device connector: P401
I2C Level Shifter: C408 C409 R410-R413 U405
I2C Test Connector: P402

### Ports
IACT (bidir, see Top[2C]), SCL (bidir, see Top[2C]), SDA (bidir, see Top[2C]), VDDM_ADJ (bidir, see Top[2C], DAC[2D]), VDDM_EN (bidir, see Top[2C]), VMEAS (bidir, see Top[2C])

### Nets
+3.3V: C401.2 C408.2 R411.2 R412.2 U402.1(VIN) U403.7(+V) U405.2(OE) U405.3(VCCA)
+5VD: C400.2 C403.2(A) C404.2 RP400.2 U401.8(+V) U404.8(IN)
+12V: C410.2 U400.8(+VS)
GND: C400.1 C401.1 C402.1 C403.1(C) C404.1 C405.1 C406.1(C) C408.1 C409.1 C410.1 P400.4 P401.1 P401.5 P402.4 R401.1 R405.1 R407.1 R408.1 U400.5(-VS) U401.4(-V) U402.3(GND) U403.4(-V) U404.3(NC) U404.4(NC) U404.5(GND) U404.6(NC) U404.9(PAD) U405.6(GND)
VDD_AF: P401.7
VDDM: C409.2 P401.4 P402.1 R400.1 R402.1 R410.2 R413.2 U400.1(-IN) U405.7(VCCB)
VDDP_AF: P400.2
VDDP_OIS: P400.1 P401.8
ADJ: R406.1 R408.2 R409.2 U404.2(FB)
~{EN}: R407.2 RP400.1 U404.7(EN) ; port VDDM_EN
IACT: U400.7(VOUT) ; port IACT
M_VREF: R404.1 R405.2 U403.3(+IN)
SCL: R412.1 U405.1(SCL_A) ; port SCL
SCL_AF: P401.2 P402.3 R413.1 U405.8(SCL_B)
SDA: R411.1 U405.4(SDA_A) ; port SDA
SDA_AF: P401.3 P402.2 R410.1 U405.5(SDA_B)
VDDM_ADJ: R409.1 ; port VDDM_ADJ
VDDM_SRC: C405.2 C406.2(A) R402.2 R406.2 U400.4(+IN) U404.1(OUT)
VMEAS: U401.6(-IN_B) U401.7(OUT_B) ; port VMEAS
VREF_ACT: U400.6(REF) U403.2(-IN) U403.6(OUT)
NetC402_2: C402.2 R404.2 U402.2(VOUT)
NetR400_2: R400.2 R401.2 U401.5(+IN_B)
NetR403_1: R403.1 U400.2(1_RG)
NetR403_2: R403.2 U400.3(2_RG)

Not connected (* = marked no-connect by the designer): P400 3*; P401 6*

### Notes on the sheet
- Active current measurement
- Reference Voltage
- (near R404) VREF value:
  1.5V* 1k/(1k+12k) = 125mV
- VDDM Voltage Source
- 1.8V
- 1.2VREF
  Division ratio for 1.8V: 2/3
- 2023/09/12 UPDATE:
  Previous values:
  R406: 10k
  R408: 20k
  Updated to:
- (near RP400) DNF
- 2023/09/12 UPDATE:
  RP400 REMOVED
- CNE-B04 type
  2mm pitch
- Molex 5267-08 series
  22035085
  2.5mm pitch
- (in symbol CMP-2000-07191-2) +

### Library data of the parts
C400-C402 C408-C410 = CMP-2000-05332-1: as C100 on sheet Power; Case Size/Dimension: 0603; Datasheet URL: https://datasheet.ciiva.com/29198/456651-da-01-en-vs-kondensator-0605-29198839.pdf; Manufacturer URL: http://www.samsungsem.com/global/index.jsp; Datasheet Version: Nov-10
C403 C406 = CMP-2000-07191-2: as C102 on sheet Power; Weight: 0.002293oz; Max Operating Temperature: 125°C; Failure Rate: 0.001%; Tolerance: 10%; Case Code (Metric): 3528; Case Code (Imperial): 1411; Number of Pins: 2; Case/Package: 1411; Width: 2.8mm; Height: 1.9mm; Voltage Rating: 20V; Voltage: 20V; Lead Free: Lead Free; Features: General Purpose; Radiation Hardening: No; Min Operating Temperature: -55°C; Length: 3.5mm; Mount: Surface Mount; Depth: 2.8mm; Voltage Rating (DC): 20V; Termination: SMD/SMT; Package Quantity: 1; Capacitance: 10uF; Packaging: Tape and Reel; RoHS Compliant: Yes; REACH SVHC: No SVHC; Height - Seated (Max): 0.083inch
C404 C405 = CMP-2007-00957-1: Part Number: GRM216R61E105KA12D; Manufacturer: Murata
P400 P402 = CMP-2000-05165-1: Male Header, Pitch 2 mm, 1 x 4 Position, Height 6 mm, Tail Length 3.4 mm, -25 to 85 degC, RoHS, Bulk; Manufacturer: JST; No of Positions: 4; Style/Orientation: StraightHeader/Plug; Pitch: 2mm; Datasheet URL: http://datasheet.octopart.com/B4B-PH-K-S%28LF%29%28SN%29-JST-datasheet-10558886.pdf; Type: ShroudedHeader; Manufacturer URL: http://www.jst.com/home2.html; Termination: Crimp; Datasheet Version: Apr-09
P401 = 22035085: 2.50mm Pitch, Mini-SPOX PCB Header, Single Row, Vertical, Through Hole, Tin Plating, 8 Circuits, Bag, 3.50mm PC Tail Length; Price: None; Availability: Unavailable; Package: None; MP: 22035085; Value: *
R400 = CMP-2000-00460-1: as R306 on sheet Source_VDDP
R401 = CMP-1012-00109-2: as R307 on sheet Source_VDDP
R402 = CMP-2001-04350-1: as R303 on sheet Source_VDDP
R403 = CMP-2000-00214-2: as R305 on sheet Source_VDDP; Package Description: 2-Pin Surface Mount Device, Body 1.6 x 0.85 mm; Contact Plating: Tin; Number of Pins: 2; Resistance: 1.2KOhm; Length: 1.6mm; Height: 0.022inch; Number of Terminations: 2; Mount: SurfaceMount; Package Reference: 0603; Packaging: TapeandReel; Case Code (Metric): 1608; Datasheet Version: 42095.0; Datasheet URL: https://industrial.panasonic.com/cdbs/www-data/pdf/RDA0000/AOA0000C283.pdf; Depth: 0.8mm; REACH SVHC: NoSVHC; Case/Package: 0603; Min Operating Temperature: -55degC; Composition: ThickFilm; Manufacturer URL: http://www.panasonic.com/; Termination: SMD/SMT; Package Quantity: 1; Case Code (Imperial): 0603; Width: 0.031inch; Power Rating: 100mW; Voltage Rating: 75V; Lead Free: LeadFree; Package URL: http://www.st.com/st-web-ui/static/active/en/resource/technical/document/datasheet/CD00001320.pdf; RoHSCompliant: True; Tolerance: 1%; Military Standard: Not; Max Operating Temperature: 155degC
R404 = CMP-2000-00199-1: as R309 on sheet Source_VDDP
R405 = CMP-2000-00180-1: as R310 on sheet Source_VDDP
R406 R408 = CMP-1012-00623-3: Chip Resistor, 10 KOhm, +/- 1%, 0.1 W, -55 to 155 degC, 0603 (1608 Metric), RoHS, Tape and Reel; Manufacturer: Panasonic; Voltage Rating: 75V; Case\/Package: 0603; Power Rating: 100mW; Resistance: 10KOhm; Temperature Coefficient: 100ppm\/degreesC; Number of Pins: 2; Package Reference: 603; Depth: 0.8mm; Mount: SurfaceMount; Package Description: 2-Pin Surface Mount Device, Body 1.6 x 0.85 mm; Datasheet Version: 02/2017; Length: 1.6mm; Lead Free: LeadFree; Height: 0.45mm; Number of Terminations: 2; Max Power Dissipation: 100mW; Min Operating Temperature: -55degC; Datasheet URL: https://industrial.panasonic.com/cdbs/www-data/pdf/RDA0000/AOA0000C304.pdf; Termination: SMD/SMT; Case Code (Metric): 1608; Case Code (Imperial): 0603; Tolerance: 1%; Max Operating Temperature: 155degC; RoHSCompliant: true; Voltage Rating (DC): 75V; Radiation Hardening: No; Packaging: TapeandReel; Composition: ThickFilm; Mounting Technology: SurfaceMount; Manufacturer URL: http://www.panasonic.com/; Width: 0.031inch; REACH SVHC: NoSVHC; Contact Plating: Tin; Military Standard: Not; Package Quantity: 1
R407 RP400 = CMP-2000-00436-2: as R202 on sheet ADC; Datasheet Version: 42095.0; Width: 0.8mm; Mount: SurfaceMount; Radiation Hardening: No; Package URL: http://www.st.com/st-web-ui/static/active/en/resource/technical/document/datasheet/CD00001320.pdf; Depth: 0.8mm; Package Description: 2-Pin Surface Mount Device, Body 1.6 x 0.85 mm; Package Quantity: 1; Contact Plating: Tin; Length: 1.6mm; Max Operating Temperature: 155degC; RoHSCompliant: true; Datasheet URL: https://industrial.panasonic.com/cdbs/www-data/pdf/RDA0000/AOA0000C283.pdf; Height: 0.022inch; Military Standard: Not; Termination: SMD/SMT; Case Code (Metric): 1608; Composition: ThickFilm; Resistance: 3.3KOhm; Packaging: TapeandReel; Min Operating Temperature: -55degC; Case/Package: 0603; Voltage Rating (DC): 75V; Lead Free: LeadFree; Package Reference: 0603; Power Rating: 100mW; Manufacturer URL: http://www.panasonic.com/; Case Code (Imperial): 0603; REACH SVHC: NoSVHC; Number of Terminations: 2; Number of Pins: 2; Tolerance: 1%
R409 = CMP-1012-00586-3: Precision Thick Film Chip Resistor, 4.7 KOhm, +/- 1%, -55 to 155 degC, 0603 (1608 Metric), RoHS, Tape and Reel; Resistance: 220 Ohm; Voltage Rating: 50 V; Elements: 4; Case\Package: 1205; Tolerance: 5%; Power Rating: 250 mW; PackageReference: 0603; Max Operating Temperature: 125 degC; REACH SVHC: No SVHC; Width: 0.063 inch; Length: 0.126 inch; Height: 0.024 inch; Mount: Surface Mount; Package Quantity: 1; DatasheetVersion: Apr-15; ComponentLink1Description: Manufacturer URL; Min Operating Temperature: -55 degC; Packaging: Tape and Reel; Radiation Hardening: No; ComponentLink2URL: http://industrial.panasonic.com/cdbs/www-data/pdf/RDA0000/AOA0000C86.pdf; Case Code (Metric): 3216; Pins: 8; Case Code (Imperial): 1206; Type (Resistor): Thick Film; RoHSCompliant: true; ComponentLink2Description: Datasheet; PackageDescription: 2-Pin Surface Mount Device, Body 1.6 x 0.85 mm; ComponentLink1URL: http://www.panasonic.com/
R410-R413 = CMP-2000-00317-1: Part Number: ERJ-3EKF2001V; Manufacturer: Panasonic
U400 = CMP-09116-000053-1: as U301 on sheet Source_VDDP; Mount: Surface Mount; Case/Package: SOIC; Radiation Hardening: No; Number of Circuits: 1; Max Operating Temperature: 85°C; Package Quantity: 98; Number of Pins: 8; Lead Free: Contains Lead; REACH SVHC: No SVHC; Number of Channels: 1; Contact Plating: Tin; Packaging: Rail/Tube; Min Operating Temperature: -40°C; Gain Bandwidth Product: 2.2MHz; Bandwidth: 2.2MHz; Min Supply Voltage: 3.6V; Operating Supply Current: 300uA; Length: 5mm; Width: 4mm; Height: 1.5mm
U401 = CMP-0384-00551-1: as U302 on sheet Source_VDDP; Code_JEDEC: MS-012-AA; ComponentLink2Description: Datasheet; ComponentLink2URL: http://www.analog.com/static/imported-files/data_sheets/AD8601_8602_8604.pdf; ComponentLink3URL: http://www.analog.com/static/imported-files/packages/PKG_PDF/SOIC_Narrow%20(R)/R_8.pdf; ComponentLink1URL: http://www.analog.com/en/index.html; ComponentLink3Description: Package Specification; PartNumber: AD8602ARZ; Mounting Technology: Surface Mount; PackageReference: R-8; PackageDescription: 8-Pin Standard Small Outline Package, Body 3.9 x 4.9 mm, Pitch 1.27 mm; DatasheetVersion: Rev. G; PackageVersion: 060506-A; ComponentLink1Description: Manufacturer URL
U402 = CMP-13559-000003-1: IC VREF SERIES 0.5% SOT23-3; RoHS Compliant: Yes
U403 = CMP-0384-00637-2: as U306 on sheet Source_VDDP; Mounting Technology: Surface Mount; Code_JEDEC: MS-012-AA; ComponentLink4Description: Reference Circuit; ComponentLink3Description: Package Specification; PackageVersion: 060506-A; Slew Rate: 700mV/us; RevisionNote: Reference Circuit URL fixed; ComponentLink3URL: http://www.analog.com/static/imported-files/packages/PKG_PDF/SOIC_Narrow%20(R)/R_8.pdf; DatasheetVersion: Rev. G; PartNumber: OP1177ARZ; ComponentLink1URL: http://www.analog.com/en/index.html; ComponentLink1Description: Manufacturer URL; ComponentLink2URL: http://www.analog.com/static/imported-files/data_sheets/OP1177_2177_4177.pdf; PackageReference: R-8; ComponentLink4URL: http://www.analog.com/en/all-operational-amplifiers-op-amps/operational-amplifiers-op-amps/op1177/products/product.html#product-recommendations; ComponentLink2Description: Datasheet; PackageDescription: 8-Pin Standard Small Outline Package, Body 3.9 x 4.9 mm, Pitch 1.27 mm
U404 = TPS78401QWDRBRQ1: No Description Available; Mfr_Name: Texas Instruments; Type: DEV; RefDes: RefDes; Copyright: Copyright (C) 2022 Ultra Librarian. All rights reserved.; Manufacturer_Part_Number: TPS78401QWDRBRQ1
U405 = TCA9416DDFR: No Description Available; Mfr_Name: Texas Instruments; Copyright: Copyright (C) 2022 Ultra Librarian. All rights reserved.; Manufacturer_Part_Number: TCA9416DDFR; RefDes: RefDes; Type: DEV

## Nets that join several sheets
+3.3V: Power (C101.2 C102.2 U100.3), ADC (C201.2 R202.1 U200.31), Source_VDDP (C307.2 D300.1 K300.1 U305.1), Source_VDDM (8 pins)
+5VD: Power (5 pins), ADC (C200.2 U200.42 U200.43), Source_VDDP (C304.2 C309.2 U302.8 U306.7), Source_VDDM (6 pins)
+9VD: Power (6 pins), Source_VDDP (C301.2 C303.2 U300.2)
+12V: Power (5 pins), Source_VDDP (C306.2 U301.8), Source_VDDM (C410.2 U400.8)
GND: Power (26 pins), ADC (26 pins), Source_VDDP (20 pins), Source_VDDM (28 pins)
IACT: Source_VDDP (U301.7), Source_VDDM (U400.7)
VMEAS: Source_VDDP (U302.6 U302.7), Source_VDDM (U401.6 U401.7)